# Altium schematic sheet Blockschaltbild AirScoutV1.1.SchDoc
size A3
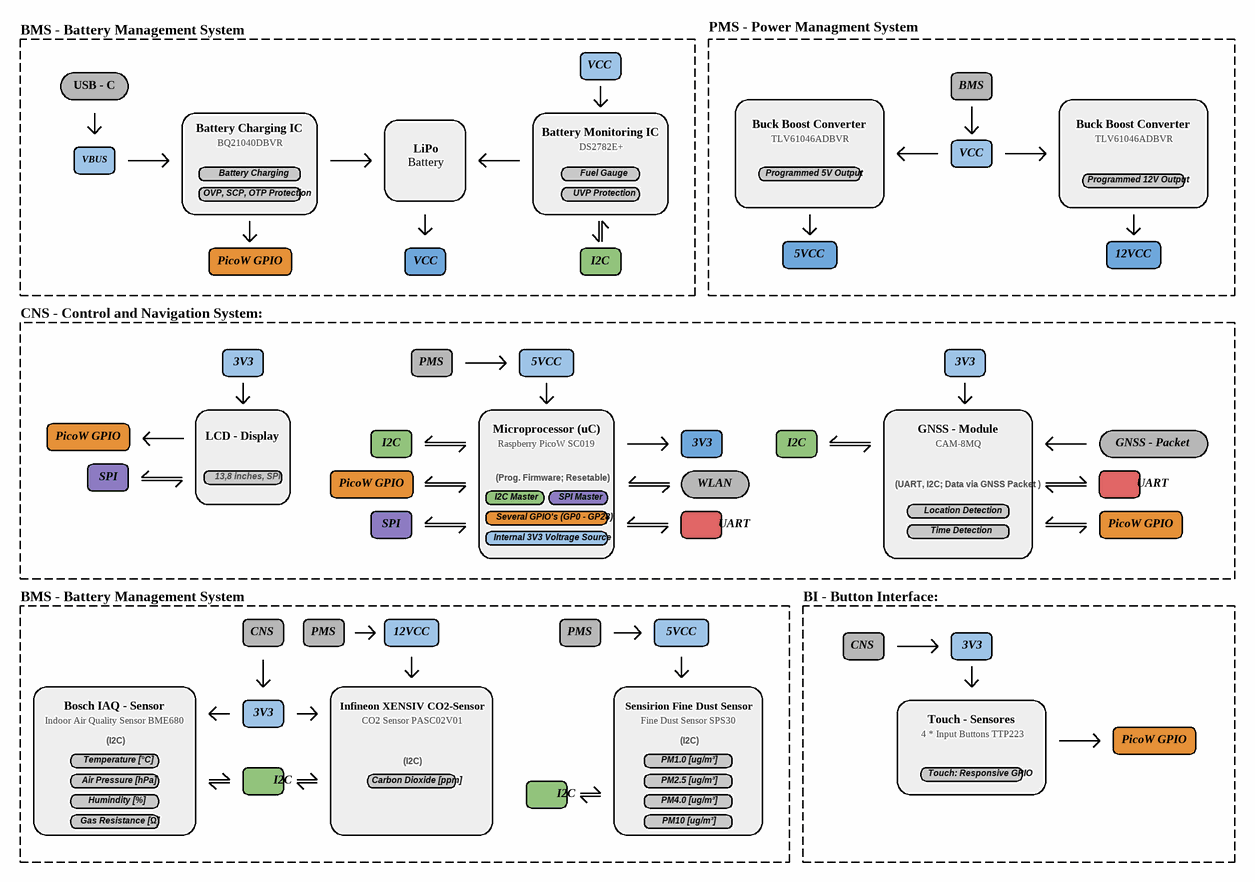
[diagram p0: Blockschaltbild AirScoutV1.1.SchDoc]

## Notes on the sheet
- BMS - Battery Management System
- PMS - Power Managment System
- USB - C
- VCC
- BMS
- VBUS
- Battery Charging IC
- BQ21040DBVR
- Battery Charging
- Battery
- LiPo
- Battery Monitoring IC
- DS2782E+
- Fuel Gauge
- Buck Boost Converter
- Programmed 5V Output
- TLV61046ADBVR
- OVP, SCP, OTP Protection
- UVP Protection
- Programmed 12V Output
- PicoW GPIO
- I2C
- 5VCC
- 12VCC
- CNS - Control and Navigation System:
- 3V3
- PMS
- LCD - Display
- Microprocessor (uC)
- Raspberry PicoW SC019
- GNSS - Module
- CAM-8MQ
- GNSS - Packet
- SPI
- 13,8 inches, SPI
- I2C Master
- (Prog. Firmware; Resetable)
- SPI Master
- WLAN
- (UART, I2C; Data via GNSS Packet )
- Location Detection
- UART
- Internal 3V3 Voltrage Source
- Several GPIO's (GP0 - GP28)
- Time Detection
- CNS
- BI - Button Interface:
- Bosch IAQ - Sensor
- Infineon XENSIV CO2-Sensor
- Sensirion Fine Dust Sensor
- Indoor Air Quality Sensor BME680
- Air Pressure [hPa]
- Temperature [°C]
- (I2C)
- CO2 Sensor PASC02V01
- Carbon Dioxide [ppm]
- Fine Dust Sensor SPS30
- PM1.0 [ug/m³]
- PM2.5 [ug/m³]
- 4 * Input Buttons TTP223
- Touch - Sensores
- Touch: Responsive GPIO
- Gas Resistance [Ω]
- Humindity [%]
- PM4.0 [ug/m³]
- PM10 [ug/m³]